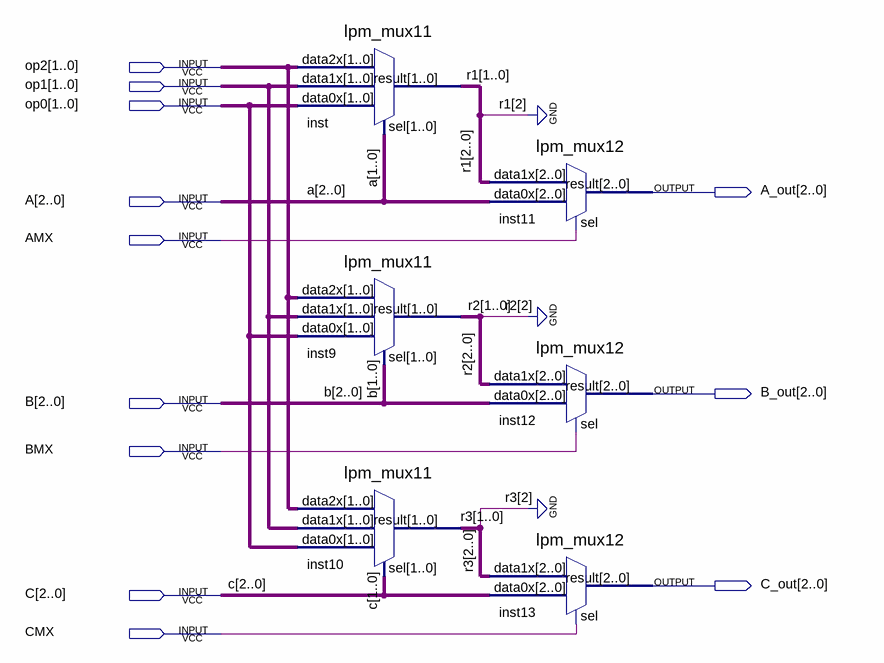
[diagram p0: schematic sheet]
// Quartus schematic OPER_CHOSE.bdf as structural Verilog: 6 symbols, 12 pins
module OPER_CHOSE (
  input  [1:0] op2,
  input  [1:0] op1,
  input  [1:0] op0,
  input  [2:0] A,
  input  AMX,
  input  [2:0] B,
  input  BMX,
  input  [2:0] C,
  input  CMX,
  output [2:0] A_out,
  output [2:0] B_out,
  output [2:0] C_out
);

  wire [1:0] r1, r2, r3;

  lpm_mux11 inst (.data2x(op2), .data1x(op1), .data0x(op0), .sel(A[1:0]), .result(r1));
  lpm_mux11 inst9 (.data2x(op2), .data1x(op1), .data0x(op0), .sel(B[1:0]), .result(r2));
  lpm_mux11 inst10 (.data2x(op2), .data1x(op1), .data0x(op0), .sel(C[1:0]), .result(r3));
  lpm_mux12 inst11 (.data1x({1'b0, r1}), .data0x(A), .sel(AMX), .result(A_out));
  lpm_mux12 inst12 (.data1x({1'b0, r2}), .data0x(B), .sel(BMX), .result(B_out));
  lpm_mux12 inst13 (.data1x({1'b0, r3}), .data0x(C), .sel(CMX), .result(C_out));
endmodule
